# Altium schematic sheet Current_Detection_Connectors.SchDoc: S88-N Occupancy Detector
size A4; DrawnBy: Sem Kirkels; DocumentNumber: 23P001S04; Revision: V1; SheetNumber: 4; SheetTotal: 6
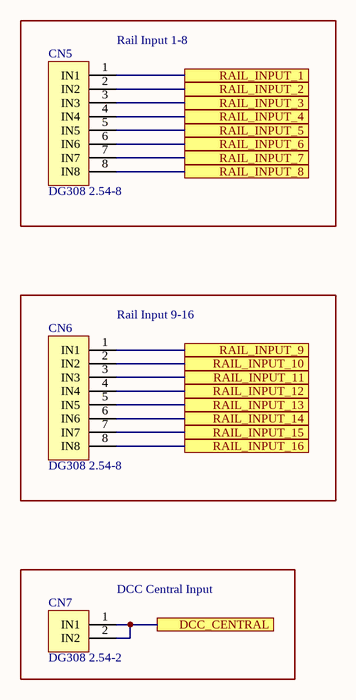
[diagram p0: Current_Detection_Connectors.SchDoc]

## Parts
CN5  DG308 2.54-8  [DG308 2.54-8]
CN6  DG308 2.54-8  [DG308 2.54-8]
CN7  DG308 2.54-2  [DG308 2.54-2]

## Blocks framed on the sheet
Rail Input 1-8: CN5
Rail Input 9-16: CN6
DCC Central Input: CN7

## Ports
DCC_CENTRAL (see Current_Detection_1_8[2A], Current_Detection_1_8[2B], Current_Detection_1_8[2C], Current_Detection_1_8[4A], Current_Detection_1_8[4B], Current_Detection_1_8[4C], Current_Detection_9_16[2A], Current_Detection_9_16[2B], Current_Detection_9_16[2C], Current_Detection_9_16[4A], Current_Detection_9_16[4B], Current_Detection_9_16[4C]), RAIL_INPUT_1 (see Current_Detection_1_8[1A]), RAIL_INPUT_2 (see Current_Detection_1_8[3A]), RAIL_INPUT_3 (see Current_Detection_1_8[1B]), RAIL_INPUT_4 (see Current_Detection_1_8[3B]), RAIL_INPUT_5 (see Current_Detection_1_8[1B]), RAIL_INPUT_6 (see Current_Detection_1_8[3B]), RAIL_INPUT_7 (see Current_Detection_1_8[1C]), RAIL_INPUT_8 (see Current_Detection_1_8[3C]), RAIL_INPUT_9 (see Current_Detection_9_16[1A]), RAIL_INPUT_10 (see Current_Detection_9_16[3A]), RAIL_INPUT_11 (see Current_Detection_9_16[1B]), RAIL_INPUT_12 (see Current_Detection_9_16[3B]), RAIL_INPUT_13 (see Current_Detection_9_16[1B]), RAIL_INPUT_14 (see Current_Detection_9_16[3B]), RAIL_INPUT_15 (see Current_Detection_9_16[1C]), RAIL_INPUT_16 (see Current_Detection_9_16[3C])

## Nets
DCC_CENTRAL: CN7.1(IN1) CN7.2(IN2) ; port DCC_CENTRAL
RAIL_INPUT_1: CN5.1(IN1) ; port RAIL_INPUT_1
RAIL_INPUT_2: CN5.2(IN2) ; port RAIL_INPUT_2
RAIL_INPUT_3: CN5.3(IN3) ; port RAIL_INPUT_3
RAIL_INPUT_4: CN5.4(IN4) ; port RAIL_INPUT_4
RAIL_INPUT_5: CN5.5(IN5) ; port RAIL_INPUT_5
RAIL_INPUT_6: CN5.6(IN6) ; port RAIL_INPUT_6
RAIL_INPUT_7: CN5.7(IN7) ; port RAIL_INPUT_7
RAIL_INPUT_8: CN5.8(IN8) ; port RAIL_INPUT_8
RAIL_INPUT_9: CN6.1(IN1) ; port RAIL_INPUT_9
RAIL_INPUT_10: CN6.2(IN2) ; port RAIL_INPUT_10
RAIL_INPUT_11: CN6.3(IN3) ; port RAIL_INPUT_11
RAIL_INPUT_12: CN6.4(IN4) ; port RAIL_INPUT_12
RAIL_INPUT_13: CN6.5(IN5) ; port RAIL_INPUT_13
RAIL_INPUT_14: CN6.6(IN6) ; port RAIL_INPUT_14
RAIL_INPUT_15: CN6.7(IN7) ; port RAIL_INPUT_15
RAIL_INPUT_16: CN6.8(IN8) ; port RAIL_INPUT_16

## Library data of the parts
CN5 CN6 = 8_Pin_Screw_Connector
CN7 = 2_Pin_Screw_Connector